# Altium schematic sheet Mains.SchDoc
size A3; SheetNumber: 2; SheetTotal: 9
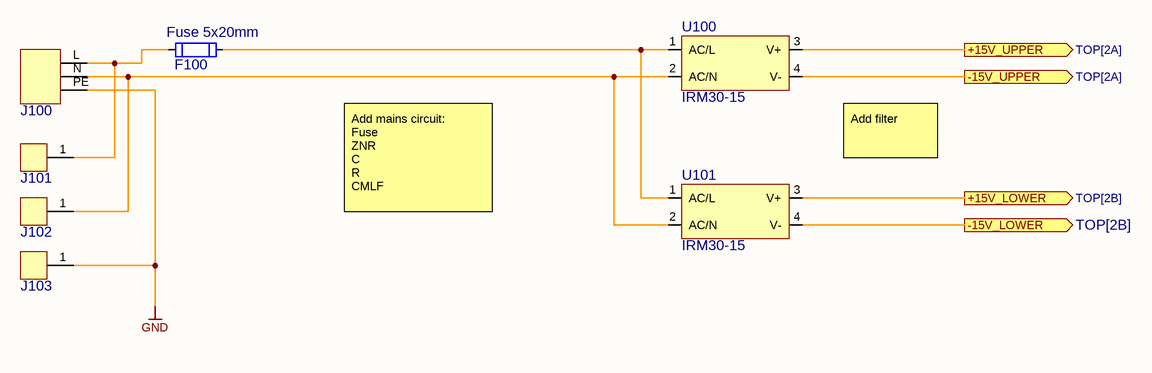
[diagram p0: Mains.SchDoc]

## Parts
F100  Fuse 5x20mm  [OGN_THR]
J100  GSP1.9203.1  [GSP1.9203.1]  (value not drawn)
J101  6.35mmx0.81mm Tab THT  [Tab_THT_635]  (value not drawn)
J102  6.35mmx0.81mm Tab THT  [Tab_THT_635]  (value not drawn)
J103  6.35mmx0.81mm Tab THT  [Tab_THT_635]  (value not drawn)
U100  IRM30-15  [IRM30]
U101  IRM30-15  [IRM30]

## Ports
+15V_LOWER (out, see TOP[2B]), +15V_UPPER (out, see TOP[2A]), -15V_LOWER (out, see TOP[2B]), -15V_UPPER (out, see TOP[2A])

## Nets
GND: J100.PE J103.1
+15V_LOWER: U101.3(V+) ; port +15V_LOWER
+15V_UPPER: U100.3(V+) ; port +15V_UPPER
-15V_LOWER: U101.4(V-) ; port -15V_LOWER
-15V_UPPER: U100.4(V-) ; port -15V_UPPER
NetF100_1: F100.1 J100.L J101.1
NetF100_2: F100.2 U100.1(AC/L) U101.1(AC/L)
NetJ100_N: J100.N J102.1 U100.2(AC/N) U101.2(AC/N)

## Notes on the sheet
- Add filter
- Add mains circuit:
  Fuse
  ZNR
  C
  R
  CMLF
- Date:
- Size:
- A3
- Schema:
- Layout:

## Library data of the parts
F100 = Fuse/5x20mm/OGN: open fuse holder, 5 x 20 mm, THR, IEC 60335-1; Manufacturer: Schurter; Manufacturer Part Number 1: 3-132-873; Part Number: Fuse/5x20mm/OGN; Package: 5X20; HelpURL: https://www.schurter.com/en/datasheet/typ_OGN.pdf; Manufacturer 1: Schurter; Supplier 1: Digi-Key; Supplier Part Number 1: 486-3-132-873-ND
J100 = GSP1.9203.1: IEC Gerätestecker C14 oder C18, Schraubmontage, rückseitig, PCB-Anschlüsse; Manufacturer: Schurter; Part Number: GSP1.9203.1; HelpURL: https://www.schurter.com/de/datasheet/GSP1; Manufacturer 1: Schurter; Manufacturer Part Number 1: GSP1.9203.1; Supplier 1: Digi-Key; Supplier Part Number 1: 486-4820-ND
J101-J103 = Tab_025_THT: CONN QC TAB 0.250 SOLDER; Manufacturer: GENERIC; Manufacturer 1: TE Connectivity AMP Connectors; Manufacturer Part Number 1: 1217861-1; Part Number: Tab_025_THT; HelpURL: https://www.te.com/usa-en/product-1217861-1.datasheet.pdf; Supplier 1: Digi-Key; Supplier Part Number 1: A100452CT-ND; Manufacturer 3: TE Connectivity; Manufacturer Part Number 3: 1217861-1; Supplier 3: LCSC; Supplier Part Number 3: C428480
U100 U101 = IRM30-15: 30W AC-DC PCB-Mount Green Power Module; Part Number: IRM30-15; Package: Module; HelpURL: https://www.meanwell-web.com/content/files/pdfs/productPdfs/MW/IRM-30/IRM-30-spec.pdf